# EAGLE schematic Schema_PcbBspd_NF (EAGLE 9.6.2)
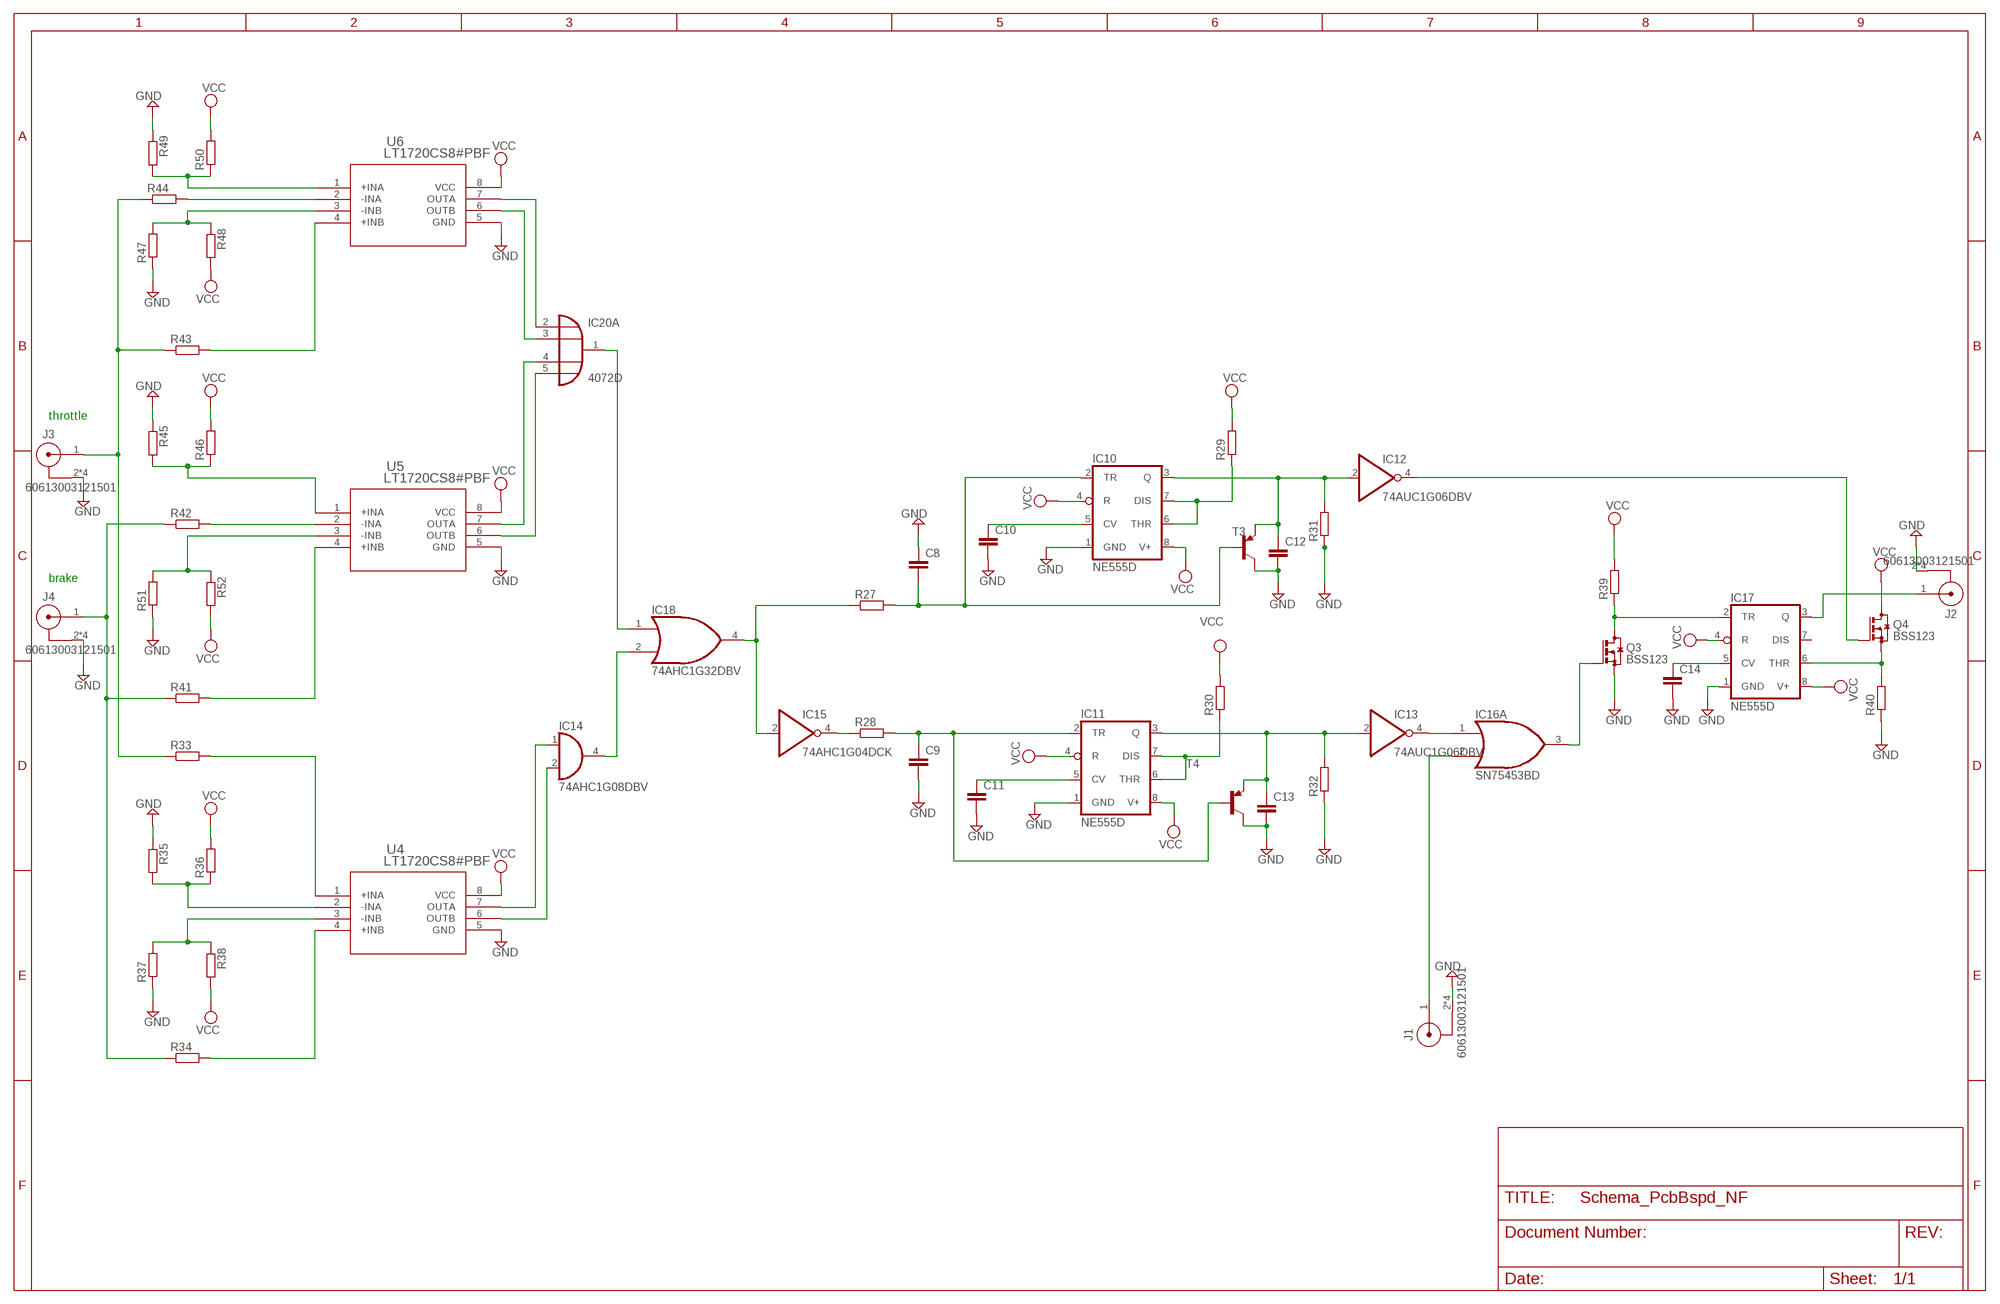
[diagram p0: schematic, sheet 1]

## Parts
C8  C2,5-3  [C2.5-3]
C9  C2,5-3  [C2.5-3]
C10  C2,5-3  [C2.5-3]
C11  C2,5-3  [C2.5-3]
C12  C2,5-3  [C2.5-3]
C13  C2,5-3  [C2.5-3]
C14  C2,5-3  [C2.5-3]
IC10  NE555D  [SO08]
IC11  NE555D  [SO08]
IC12  74AUC1G06DBV  [SOT23-5]
IC13  74AUC1G06DBV  [SOT23-5]
IC14  74AHC1G08DBV  [SOT23-5]
IC15  74AHC1G04DCK  [SC70-5]
IC16  SN75453BD  [D_R-PDSO-G8]
IC17  NE555D  [SO08]
IC18  74AHC1G32DBV  [SOT23-5]
IC20  4072D  [SO14]
J1  60613003121501  [60613003121501]
J2  60613003121501  [60613003121501]
J3  60613003121501  [60613003121501]
J4  60613003121501  [60613003121501]
Q3  BSS123  [SOT23]
Q4  BSS123  [SOT23]
R27  R-EU_R0805  [R0805]
R28  R-EU_R0805  [R0805]
R29  R-EU_R0805  [R0805]
R30  R-EU_R0805  [R0805]
R31  R-EU_R0805  [R0805]
R32  R-EU_R0805  [R0805]
R33  R-EU_R0805  [R0805]
R34  R-EU_R0805  [R0805]
R35  R-EU_R0805  [R0805]
R36  R-EU_R0805  [R0805]
R37  R-EU_R0805  [R0805]
R38  R-EU_R0805  [R0805]
R39  R-EU_R0805  [R0805]
R40  R-EU_R0805  [R0805]
R41  R-EU_R0805  [R0805]
R42  R-EU_R0805  [R0805]
R43  R-EU_R0805  [R0805]
R44  R-EU_R0805  [R0805]
R45  R-EU_R0805  [R0805]
R46  R-EU_R0805  [R0805]
R47  R-EU_R0805  [R0805]
R48  R-EU_R0805  [R0805]
R49  R-EU_R0805  [R0805]
R50  R-EU_R0805  [R0805]
R51  R-EU_R0805  [R0805]
R52  R-EU_R0805  [R0805]
T3  BC857A-PNP-SOT23-BEC  [SOT23-BEC]
T4  BC857A-PNP-SOT23-BEC  [SOT23-BEC]
U4  LT1720CS8#PBF  [SO-8_S]
U5  LT1720CS8#PBF  [SO-8_S]
U6  LT1720CS8#PBF  [SO-8_S]

## Nets
GND: C8.1 C9.2 C10.2 C11.2 C12.2 C13.2 C14.2 IC10.1(GND) IC11.1(GND) IC17.1(GND) J1.2 J1.3 J1.4 J1.5 J2.2 J2.3 J2.4 J2.5 J3.2 J3.3 J3.4 J3.5 J4.2 J4.3 J4.4 J4.5 Q3.2(S) R31.1 R32.1 R35.1 R37.1 R40.1 R45.1 R47.1 R49.1 R51.1 T3.C T4.C U4.5(GND) U5.5(GND) U6.5(GND)
N$41: IC13.4(O) IC16.1(A:I0)
N$42: IC16.3(A:O) Q3.1(G)
N$43: C10.1 IC10.5(CV)
N$44: C11.1 IC11.5(CV)
N$45: IC10.6(THR) IC10.7(DIS) R29.1
N$46: IC11.6(THR) IC11.7(DIS) R30.1
N$47: C12.1 IC10.3(Q) IC12.2(I) R31.2 T3.E
N$48: C13.1 IC11.3(Q) IC13.2(I) R32.2 T4.E
N$49: R34.2 U4.4(+INB)
N$50: R37.2 R38.1 U4.3(-INB)
N$51: R35.2 R36.1 U4.2(-INA)
N$52: R33.2 U4.1(+INA)
N$53: IC20.2(A:I0) U6.7(OUTA)
N$54: IC20.3(A:I1) U6.6(OUTB)
N$55: IC17.6(THR) Q4.2(S) R40.2
N$56: IC16.2(A:I1) J1.1
N$57: IC17.2(TR) Q3.3(D) R39.1
N$58: IC17.3(Q) J2.1
N$59: C14.1 IC17.5(CV)
N$60: IC12.4(O) Q4.1(G)
N$61: J4.1 R34.1 R41.1 R42.1
N$64: J3.1 R33.1 R43.1 R44.1
N$65: R43.2 U6.4(+INB)
N$66: R41.2 U5.4(+INB)
N$67: R44.2 U6.2(-INA)
N$68: R42.2 U5.2(-INA)
N$69: R47.2 R48.1 U6.3(-INB)
N$70: R49.2 R50.1 U6.1(+INA)
N$71: R45.2 R46.1 U5.1(+INA)
N$72: IC20.4(A:I2) U5.7(OUTA)
N$73: IC20.5(A:I3) U5.6(OUTB)
N$74: IC14.1(I0) U4.7(OUTA)
N$75: IC14.2(I1) U4.6(OUTB)
N$76: IC18.1(I0) IC20.1(A:O)
N$77: IC14.4(O) IC18.2(I1)
N$78: IC15.2(I) IC18.4(O) R27.1
N$79: IC15.4(O) R28.1
N$80: C8.2 IC10.2(TR) R27.2 T3.B
N$81: C9.1 IC11.2(TR) R28.2 T4.B
N$82: R51.2 R52.1 U5.3(-INB)
VCC: IC10.4(R) IC10.8(V+) IC11.4(R) IC11.8(V+) IC17.4(R) IC17.8(V+) Q4.3(D) R29.2 R30.2 R36.2 R38.2 R39.2 R46.2 R48.2 R50.2 R52.2 U4.8(VCC) U5.8(VCC) U6.8(VCC)
Unconnected: IC16.5(B:O) IC16.6(B:I1) IC16.7(B:I0) IC17.7(DIS) IC20.9(B:I0) IC20.10(B:I1) IC20.11(B:I2) IC20.12(B:I3) IC20.13(B:O)

## Notes on the sheet
- throttle
- brake

## Power pins joined to a net without a drawn wire
GND: IC12.3(GND) IC13.3(GND) IC14.3(GND) IC15.3(GND) IC16.4(P:GND) IC18.3(GND)
VCC: IC12.5(VCC) IC13.5(VCC) IC14.5(VCC) IC15.5(VCC) IC16.8(P:VCC) IC18.5(VCC)
VDD: IC20.14(P:VDD)
VSS: IC20.7(P:VSS)

## Library data of the parts
C8-C14 = capacitor-wima:C: CAPACITOR naming: grid - package width
IC10 IC11 IC17 = linear:*555: TIMER
IC12 IC13 = 74xx-little-de:74*1G06: Single Inverter Buffer/Driver With Open-Drain Output
IC14 = 74xx-little-de:74*1G08: 2-input AND gate
IC15 = 74xx-little-de:74*1G04: INVERTER Gate
IC16 = texas-sn55-sn75:SN75453B: OR PERIPHERAL DRIVERS FOR HIGH-CURRENT SWITCHING AT VERY HIGH SPEEDS Source: www.ti.com sn75452b.pdf
IC18 = 74xx-little-us:74*1G32: 2-input OR gate
IC20 = 40xx:4072: Dual 4-input OR
J1-J4 = 60613003121501:60613003121501: Right Angle Solder Leg 3.94mm MCX PCB THT Plug MATERIAL PROPERTIES Insulator Material PTFE Center Contact Material Beryllium Copper Center Contact Plating Gold, min. 0.076µm over Nickel Body Material Brass Body Plating Gold, min. 0.076µm over Nickel KIND PROPERTIES Interface IEC 61169-36 Connector Type MCX Gender Plug Orientation Type Right Angle GENERAL INFORMATION Operating Temperature -55 up to +155 °C ELECTRICAL PROPERTIES Impedance 50 Ω Frequency Range DC~6 GHz MECHANICAL PROPERTIES Mating Cycle 500 Cycles PACKAGINGPROPERTIES Qty. 180 <https://www.we-online.com/catalog/media/o150556v209%20Family_WR-MCX_60613003121501.jpg> Details see: https://www.we-online.com/katalog/en/em/WR-MCX_60613003121501 Updated by Ella Wu 2019-11-04 2019 (C) Würth Elektronik Check availability <https://pricing.snapeda.com/parts/60613003121501/Wurth%20Elektronik/view-part?ref=eda>; AVAILABILITY: In Stock; CHECK_PRICES: https://www.snapeda.com/parts/60613003121501/Wurth+Elektronik/view-part/?ref=eda; DESCRIPTION: Right Angle_Solder Length 3.94mm; MF: Wurth Elektronik; MP: 60613003121501; PACKAGE: None; PRICE: None; SNAPEDA_LINK: https://www.snapeda.com/parts/60613003121501/Wurth+Elektronik/view-part/?ref=snap
Q3 Q4 = transistor-small-signal:BSS123: N-CHANNEL MOS FET
R27-R52 = rcl:R-EU_: RESISTOR, European symbol; SPICEPREFIX: R
T3 T4 = transistor:*-PNP-: PNP Transistror
U4-U6 = LT1720CS8_PBF:LT1720CS8#PBF: Check availability <https://pricing.snapeda.com/parts/LT1720CS8%23PBF/Analog%20Devices/view-part?ref=eda>; AVAILABILITY: In Stock; CHECK_PRICES: https://www.snapeda.com/parts/LT1720CS8%23PBF/Analog+Devices/view-part/?ref=eda; DESCRIPTION: LT1720 - Dual, 4.5ns, Single Supply 3V/5V Comparators with Rail-to-Rail Outputs; MF: Analog Devices; MP: LT1720CS8#PBF; PACKAGE: SO-8 Linear Technology; PRICE: None; SNAPEDA_LINK: https://www.snapeda.com/parts/LT1720CS8%23PBF/Analog+Devices/view-part/?ref=snap